# Altium schematic sheet S05_SOM2_A_B.SchDoc: SOM2 A & B
size 381 x 241 mm; SheetNumber: 5; SheetTotal: 12
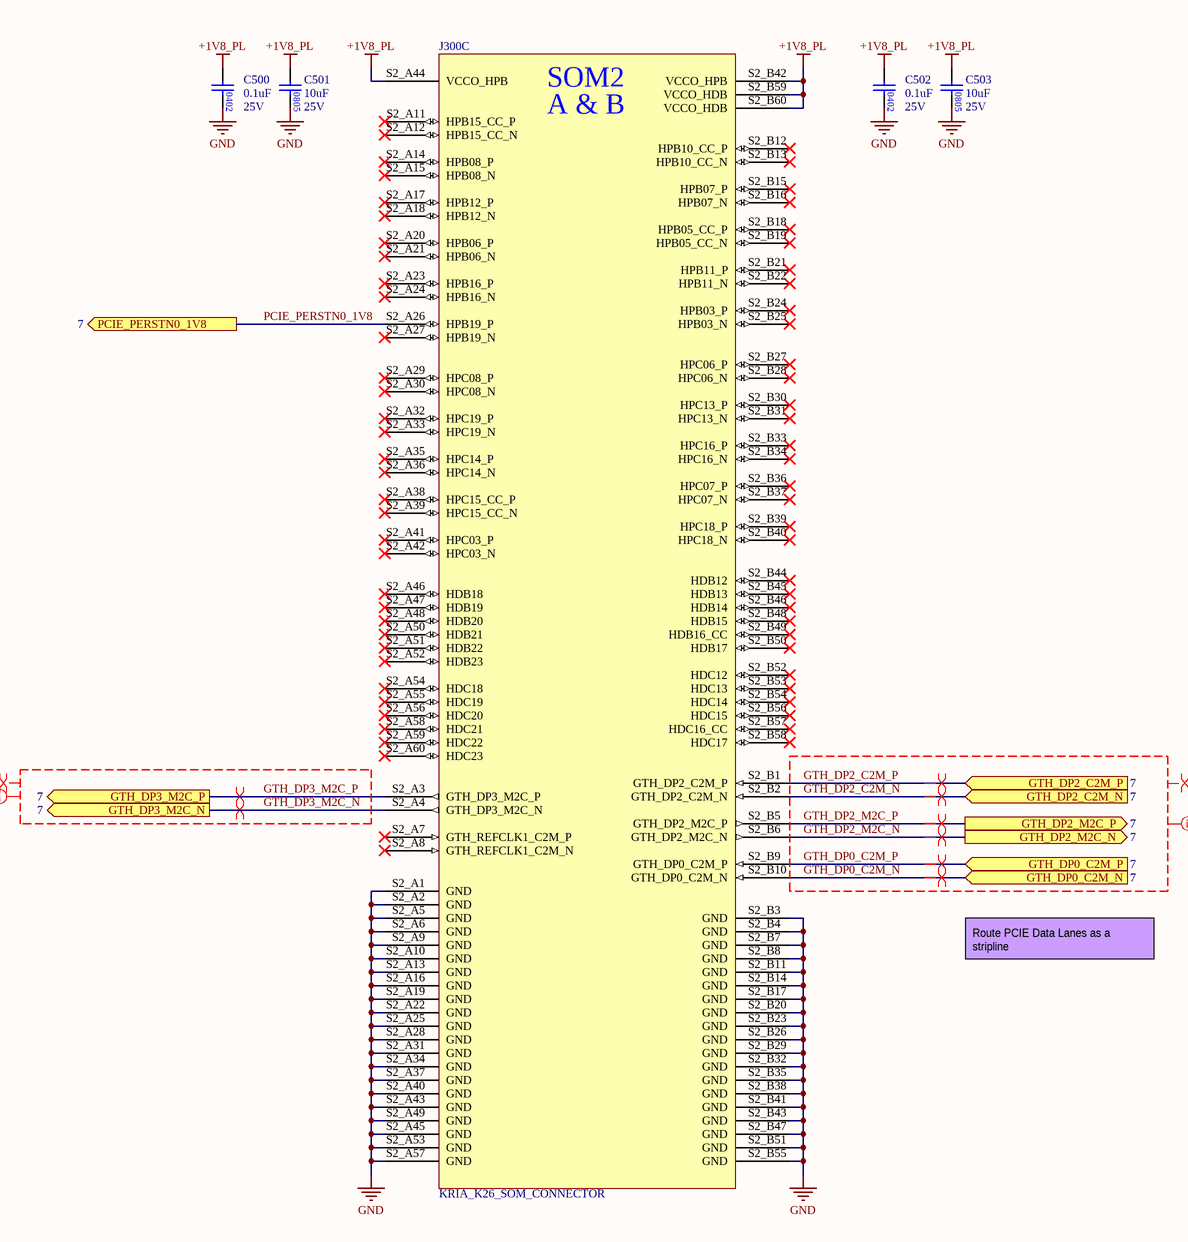
[diagram p0: S05_SOM2_A_B.SchDoc]

## Parts
C500  value 0.1uF  Voltage Rating: 25V  [CAP0402]  (hidden comment: CAP_0402)
C501  value 10uF  Voltage Rating: 25V  [CAP0805]  (hidden comment: CAP_0805)
C502  value 0.1uF  Voltage Rating: 25V  [CAP0402]  (hidden comment: CAP_0402)
C503  value 10uF  Voltage Rating: 25V  [CAP0805]  (hidden comment: CAP_0805)
J300  KRIA_K26_SOM_CONNECTOR  [KRIA_K26_SOM]  (part C of 4)

## Ports
GTH_DP0_C2M_N (in, see 7), GTH_DP0_C2M_P (in, see 7), GTH_DP2_C2M_N (in, see 7), GTH_DP2_C2M_P (in, see 7), GTH_DP2_M2C_N (out, see 7), GTH_DP2_M2C_P (out, see 7), GTH_DP3_M2C_N (out, see 7), GTH_DP3_M2C_P (out, see 7), PCIE_PERSTN0_1V8 (out, see 7)

## Nets
+1V8_PL: C500.1 C501.1 C502.1 C503.1 J300.S2_A44(VCCO_HPB) J300.S2_B42(VCCO_HPB) J300.S2_B59(VCCO_HDB) J300.S2_B60(VCCO_HDB)
GND: C500.2 C501.2 C502.2 C503.2 J300.S2_A1(GND) J300.S2_A2(GND) J300.S2_A5(GND) J300.S2_A6(GND) J300.S2_A9(GND) J300.S2_A10(GND) J300.S2_A13(GND) J300.S2_A16(GND) J300.S2_A19(GND) J300.S2_A22(GND) J300.S2_A25(GND) J300.S2_A28(GND) J300.S2_A31(GND) J300.S2_A34(GND) J300.S2_A37(GND) J300.S2_A40(GND) J300.S2_A43(GND) J300.S2_A45(GND) J300.S2_A49(GND) J300.S2_A53(GND) J300.S2_A57(GND) J300.S2_B3(GND) J300.S2_B4(GND) J300.S2_B7(GND) J300.S2_B8(GND) J300.S2_B11(GND) J300.S2_B14(GND) J300.S2_B17(GND) J300.S2_B20(GND) J300.S2_B23(GND) J300.S2_B26(GND) J300.S2_B29(GND) J300.S2_B32(GND) J300.S2_B35(GND) J300.S2_B38(GND) J300.S2_B41(GND) J300.S2_B43(GND) J300.S2_B47(GND) J300.S2_B51(GND) J300.S2_B55(GND)
GTH_DP0_C2M_N: J300.S2_B10(GTH_DP0_C2M_N) ; port GTH_DP0_C2M_N
GTH_DP0_C2M_P: J300.S2_B9(GTH_DP0_C2M_P) ; port GTH_DP0_C2M_P
GTH_DP2_C2M_N: J300.S2_B2(GTH_DP2_C2M_N) ; port GTH_DP2_C2M_N
GTH_DP2_C2M_P: J300.S2_B1(GTH_DP2_C2M_P) ; port GTH_DP2_C2M_P
GTH_DP2_M2C_N: J300.S2_B6(GTH_DP2_M2C_N) ; port GTH_DP2_M2C_N
GTH_DP2_M2C_P: J300.S2_B5(GTH_DP2_M2C_P) ; port GTH_DP2_M2C_P
GTH_DP3_M2C_N: J300.S2_A4(GTH_DP3_M2C_N) ; port GTH_DP3_M2C_N
GTH_DP3_M2C_P: J300.S2_A3(GTH_DP3_M2C_P) ; port GTH_DP3_M2C_P
PCIE_PERSTN0_1V8: J300.S2_A26(HPB19_P) ; port PCIE_PERSTN0_1V8

Not connected (* = marked no-connect by the designer): J300 S2_A7(GTH_REFCLK1_C2M_P)* S2_A8(GTH_REFCLK1_C2M_N)* S2_A11(HPB15_CC_P)* S2_A12(HPB15_CC_N)* S2_A14(HPB08_P)* S2_A15(HPB08_N)* S2_A17(HPB12_P)* S2_A18(HPB12_N)* S2_A20(HPB06_P)* S2_A21(HPB06_N)* S2_A23(HPB16_P)* S2_A24(HPB16_N)* S2_A27(HPB19_N)* S2_A29(HPC08_P)* S2_A30(HPC08_N)* S2_A32(HPC19_P)* S2_A33(HPC19_N)* S2_A35(HPC14_P)* S2_A36(HPC14_N)* S2_A38(HPC15_CC_P)* S2_A39(HPC15_CC_N)* S2_A41(HPC03_P)* S2_A42(HPC03_N)* S2_A46(HDB18)* S2_A47(HDB19)* S2_A48(HDB20)* S2_A50(HDB21)* S2_A51(HDB22)* S2_A52(HDB23)* S2_A54(HDC18)* S2_A55(HDC19)* S2_A56(HDC20)* S2_A58(HDC21)* S2_A59(HDC22)* S2_A60(HDC23)* S2_B12(HPB10_CC_P)* S2_B13(HPB10_CC_N)* S2_B15(HPB07_P)* S2_B16(HPB07_N)* S2_B18(HPB05_CC_P)* S2_B19(HPB05_CC_N)* S2_B21(HPB11_P)* S2_B22(HPB11_N)* S2_B24(HPB03_P)* S2_B25(HPB03_N)* S2_B27(HPC06_P)* S2_B28(HPC06_N)* S2_B30(HPC13_P)* S2_B31(HPC13_N)* S2_B33(HPC16_P)* S2_B34(HPC16_N)* S2_B36(HPC07_P)* S2_B37(HPC07_N)* S2_B39(HPC18_P)* S2_B40(HPC18_N)* S2_B44(HDB12)* S2_B45(HDB13)* S2_B46(HDB14)* S2_B48(HDB15)* S2_B49(HDB16_CC)* S2_B50(HDB17)* S2_B52(HDC12)* S2_B53(HDC13)* S2_B54(HDC14)* S2_B56(HDC15)* S2_B57(HDC16_CC)* S2_B58(HDC17)*

## Layout directives
differential pair: GTH_DP0_C2M_N, GTH_DP0_C2M_P, GTH_DP2_C2M_N, GTH_DP2_C2M_P, GTH_DP2_M2C_N, GTH_DP2_M2C_P, GTH_DP3_M2C_N, GTH_DP3_M2C_P
differential pair; differential pair class DIFFPAIR90: GTH_DP0_C2M_N, GTH_DP0_C2M_P, GTH_DP2_C2M_N, GTH_DP2_C2M_P, GTH_DP2_M2C_N, GTH_DP2_M2C_P, GTH_DP3_M2C_N, GTH_DP3_M2C_P
net class DIFFPAIR_GTH: GTH_DP0_C2M_N, GTH_DP0_C2M_P, GTH_DP2_C2M_N, GTH_DP2_C2M_P, GTH_DP2_M2C_N, GTH_DP2_M2C_P, GTH_DP3_M2C_N, GTH_DP3_M2C_P

## Notes on the sheet
- Route PCIE Data Lanes as a stripline
- Engineer
- Date
- Revision
- Sheet Number
- (in symbol KRIA_K26_SOM, part C) SOM2; A & B

## Library data of the parts
C500 C502 = CAP_CL05A104KA5NNNC: CAP CER 0.1UF 25V X5R 0402; Manufacturer: Samsung Electro-Mechanics; Tolerance: 10%; Manufacturer Part Number 1: CL05A104KA5NNNC; Case/Package: 0402; Mounting Type: Surface Mount; Temperature Coefficient: X5R
C501 C503 = CAP_CL21A106KAYNNNE: CAP CER 10UF 25V X5R 0805; Manufacturer: Samsung Electro-Mechanics; Tolerance: 10%; Manufacturer Part Number 1: CL21A106KAYNNNE; Case/Package: 0805; Mounting Type: Surface Mount; Temperature Coefficient: X5R
J300 = KRIA_K26_SOM: 2 x 240 pos Samtec REF-226081-01; Number of Positions: 480; Manufacturer: Samtec; Manufacturer Part NUmber: REF-226081-01; Number of Rows: 8